# Altium schematic sheet P5b_Filter2A.SchDoc
size A
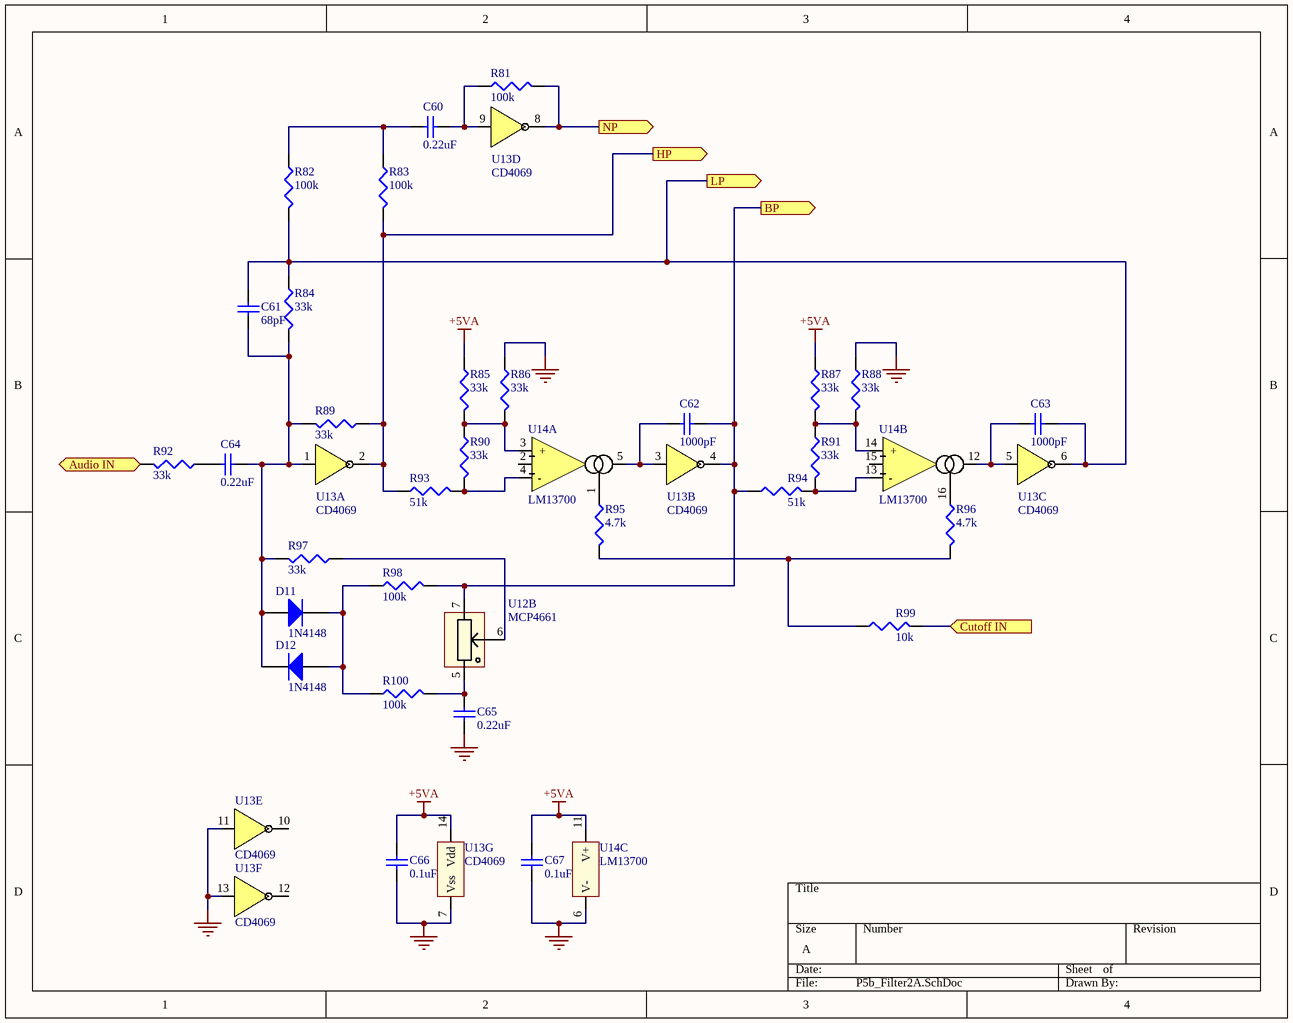
[diagram p0: P5b_Filter2A.SchDoc]

## Parts
C60  0.22uF  [CAP 0603 (1608 metric)]
C61  68pF  [CAP 0603 (1608 metric)]
C62  1000pF  [CAP 0603 (1608 metric)]
C63  1000pF  [CAP 0603 (1608 metric)]
C64  0.22uF  [CAP 0603 (1608 metric)]
C65  0.22uF  [CAP 0603 (1608 metric)]
C66  0.1uF  [CAP 0603 (1608 metric)]
C67  0.1uF  [CAP 0603 (1608 metric)]
D11  1N4148
D12  1N4148
R81  100k  [RES 0603 (1608 metric)]
R82  100k  [RES 0603 (1608 metric)]
R83  100k  [RES 0603 (1608 metric)]
R84  33k  [RES 0603 (1608 metric)]
R85  33k  [RES 0603 (1608 metric)]
R86  33k  [RES 0603 (1608 metric)]
R87  33k  [RES 0603 (1608 metric)]
R88  33k  [RES 0603 (1608 metric)]
R89  33k  [RES 0603 (1608 metric)]
R90  33k  [RES 0603 (1608 metric)]
R91  33k  [RES 0603 (1608 metric)]
R92  33k  [RES 0603 (1608 metric)]
R93  51k  [RES 0603 (1608 metric)]
R94  51k  [RES 0603 (1608 metric)]
R95  4.7k  [RES 0603 (1608 metric)]
R96  4.7k  [RES 0603 (1608 metric)]
R97  33k  [RES 0603 (1608 metric)]
R98  100k  [RES 0603 (1608 metric)]
R99  10k  [RES 0603 (1608 metric)]
R100  100k  [RES 0603 (1608 metric)]
U12  MCP4661  (part B of 4)
U13  CD4069  (parts A,B,C,D,E,F,G of 7)
U14  LM13700  (parts A,B,C of 3)

## Ports
Audio IN (in), BP (out), Cutoff IN (in), HP (out), LP (out), NP (out)

## Nets
+5VA: C66.1 C67.1 R85.1 R87.1 U13.14(Vdd) U14.11(V+)
GND: C65.2 C66.2 C67.2 R86.1 R88.1 U13.7(Vss) U13.11(E) U13.13(F) U14.6(V-)
Audio IN: R92.2 ; port Audio IN
BP: C62.2 R94.1 R98.2 U12.7(P1A) U13.4(~{B}) ; port BP
Cutoff IN: R99.2 ; port Cutoff IN
HP: R83.2 R89.1 R93.1 U13.2(~{A}) ; port HP
LP: C61.2 C63.2 R82.2 R84.1 U13.6(~{C}) ; port LP
NP: R81.2 U13.8(~{D}) ; port NP
NetC60_1: C60.1 R82.1 R83.1
NetC60_2: C60.2 R81.1 U13.9(D)
NetC61_1: C61.1 C64.2 D11.1(A) D12.2(K) R84.2 R89.2 R97.2 U13.1(A)
NetC62_1: C62.1 U13.3(B) U14.5(OUT)
NetC63_1: C63.1 U13.5(C) U14.12(OUT)
NetC64_1: C64.1 R92.1
NetC65_1: C65.1 R100.2 U12.5(P1B)
NetD11_2: D11.2(K) D12.1(A) R98.1 R100.1
NetR85_2: R85.2 R86.2 R90.1 U14.3(+)
NetR87_2: R87.2 R88.2 R91.1 U14.14(+)
NetR90_2: R90.2 R93.2 U14.4(-)
NetR91_2: R91.2 R94.2 U14.13(-)
NetR95_1: R95.1 U14.1(BIAS)
NetR95_2: R95.2 R96.2 R99.1
NetR96_1: R96.1 U14.16(BIAS)
NetR97_1: R97.1 U12.6(P1W)

Not connected (* = marked no-connect by the designer): U13 10(~{E}) 12(~{F}); U14 2(Diode_BIAS) 15(Diode_BIAS)

## Library data of the parts
C60-C67 = Cap Semi: Capacitor (Semiconductor SIM Model)
  C60 C64 C65: Value: 0.22uF
  C61: Value: 68pF
  C62 C63: Value: 1000pF
  C66 C67: Value: 0.1uF
D11 D12 = Diode 1N4148: High Conductance Fast Diode
R81-R100 = Res3: Resistor
  R81-R83 R98 R100: Value: 100k
  R84-R92 R97: Value: 33k
  R93 R94: Value: 51k
  R95 R96: Value: 4.7k
  R99: Value: 10k
U12 = MCP4661: Dual DigiPot non volatile I2C
U13 = CD4069: Hex Inverter
U14 = LM13700M: Dual Transconductance OpAmp